# Altium schematic sheet Digit.SchDoc
size A3; DocumentNumber: 2; SheetNumber: 2; SheetTotal: 7
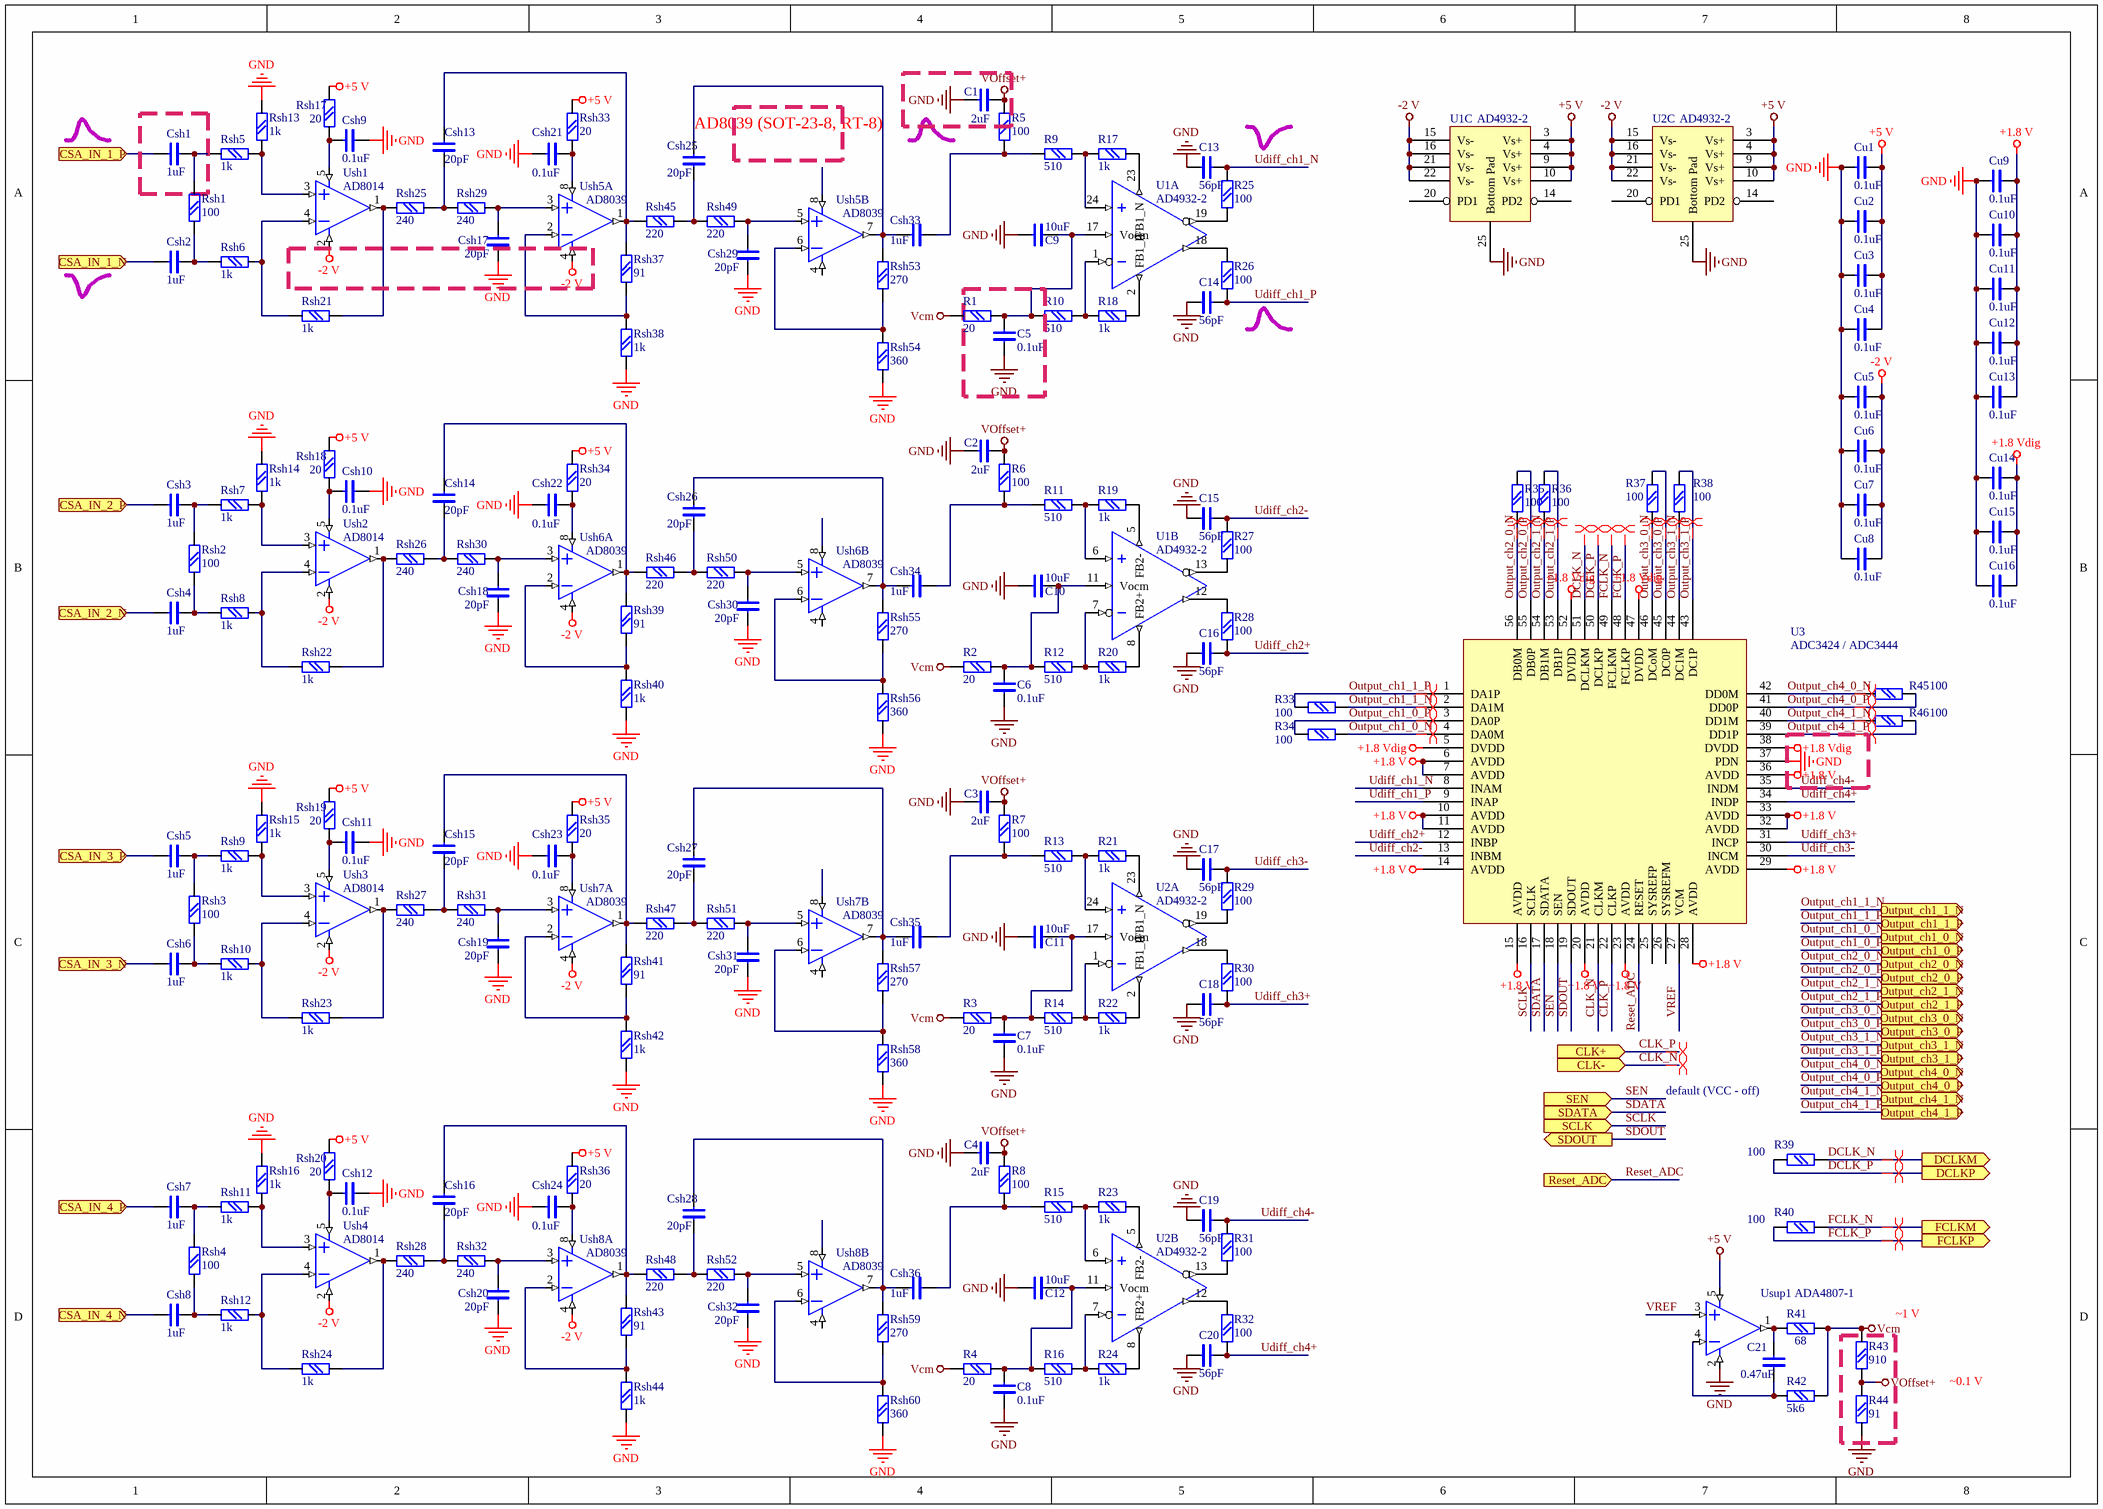
[diagram p0: Digit.SchDoc]

## Parts
C1  2uF  [chip0603]
C2  2uF  [chip0603]
C3  2uF  [chip0603]
C4  2uF  [chip0603]
C5  0.1uF  [chip0603]
C6  0.1uF  [chip0603]
C7  0.1uF  [chip0603]
C8  0.1uF  [chip0603]
C9  10uF  [chip0603]
C10  10uF  [chip0603]
C11  10uF  [chip0603]
C12  10uF  [chip0603]
C13  56pF  [chip0603]
C14  56pF  [chip0603]
C15  56pF  [chip0603]
C16  56pF  [chip0603]
C17  56pF  [chip0603]
C18  56pF  [chip0603]
C19  56pF  [chip0603]
C20  56pF  [chip0603]
C21  0.47uF  [chip0603]
Csh1  1uF  [chip0603]
Csh2  1uF  [chip0603]
Csh3  1uF  [chip0603]
Csh4  1uF  [chip0603]
Csh5  1uF  [chip0603]
Csh6  1uF  [chip0603]
Csh7  1uF  [chip0603]
Csh8  1uF  [chip0603]
Csh9  0.1uF  [chip0603]
Csh10  0.1uF  [chip0603]
Csh11  0.1uF  [chip0603]
Csh12  0.1uF  [chip0603]
Csh13  20pF  [chip0603]
Csh14  20pF  [chip0603]
Csh15  20pF  [chip0603]
Csh16  20pF  [chip0603]
Csh17  20pF  [chip0603]
Csh18  20pF  [chip0603]
Csh19  20pF  [chip0603]
Csh20  20pF  [chip0603]
Csh21  0.1uF  [chip0603]
Csh22  0.1uF  [chip0603]
Csh23  0.1uF  [chip0603]
Csh24  0.1uF  [chip0603]
Csh25  20pF  [chip0603]
Csh26  20pF  [chip0603]
Csh27  20pF  [chip0603]
Csh28  20pF  [chip0603]
Csh29  20pF  [chip0603]
Csh30  20pF  [chip0603]
Csh31  20pF  [chip0603]
Csh32  20pF  [chip0603]
Csh33  1uF  [chip0603]
Csh34  1uF  [chip0603]
Csh35  1uF  [chip0603]
Csh36  1uF  [chip0603]
Cu1  0.1uF  [chip0603]
Cu2  0.1uF  [chip0603]
Cu3  0.1uF  [chip0603]
Cu4  0.1uF  [chip0603]
Cu5  0.1uF  [chip0603]
Cu6  0.1uF  [chip0603]
Cu7  0.1uF  [chip0603]
Cu8  0.1uF  [chip0603]
Cu9  0.1uF  [chip0603]
Cu10  0.1uF  [chip0603]
Cu11  0.1uF  [chip0603]
Cu12  0.1uF  [chip0603]
Cu13  0.1uF  [chip0603]
Cu14  0.1uF  [chip0603]
Cu15  0.1uF  [chip0603]
Cu16  0.1uF  [chip0603]
R1  20  [chip0603]
R2  20  [chip0603]
R3  20  [chip0603]
R4  20  [chip0603]
R5  100  [chip0603]
R6  100  [chip0603]
R7  100  [chip0603]
R8  100  [chip0603]
R9  510  [chip0603]
R10  510  [chip0603]
R11  510  [chip0603]
R12  510  [chip0603]
R13  510  [chip0603]
R14  510  [chip0603]
R15  510  [chip0603]
R16  510  [chip0603]
R17  1k  [chip0603]
R18  1k  [chip0603]
R19  1k  [chip0603]
R20  1k  [chip0603]
R21  1k  [chip0603]
R22  1k  [chip0603]
R23  1k  [chip0603]
R24  1k  [chip0603]
R25  100  [chip0603]
R26  100  [chip0603]
R27  100  [chip0603]
R28  100  [chip0603]
R29  100  [chip0603]
R30  100  [chip0603]
R31  100  [chip0603]
R32  100  [chip0603]
R33  100  [0402]
R34  100  [0402]
R35  100  [0402]
R36  100  [0402]
R37  100  [0402]
R38  100  [0402]
R39  100  [0402]
R40  100  [0402]
R41  68  [chip0603]
R42  5k6  [chip0603]
R43  910  [chip0603]
R44  91  [chip0603]
R45  100  [0402]
R46  100  [0402]
Rsh1  100  [chip0603]
Rsh2  100  [chip0603]
Rsh3  100  [chip0603]
Rsh4  100  [chip0603]
Rsh5  1k  [chip0603]
Rsh6  1k  [chip0603]
Rsh7  1k  [chip0603]
Rsh8  1k  [chip0603]
Rsh9  1k  [chip0603]
Rsh10  1k  [chip0603]
Rsh11  1k  [chip0603]
Rsh12  1k  [chip0603]
Rsh13  1k  [chip0603]
Rsh14  1k  [chip0603]
Rsh15  1k  [chip0603]
Rsh16  1k  [chip0603]
Rsh17  20  [chip0603]
Rsh18  20  [chip0603]
Rsh19  20  [chip0603]
Rsh20  20  [chip0603]
Rsh21  1k  [chip0603]
Rsh22  1k  [chip0603]
Rsh23  1k  [chip0603]
Rsh24  1k  [chip0603]
Rsh25  240  [chip0603]
Rsh26  240  [chip0603]
Rsh27  240  [chip0603]
Rsh28  240  [chip0603]
Rsh29  240  [chip0603]
Rsh30  240  [chip0603]
Rsh31  240  [chip0603]
Rsh32  240  [chip0603]
Rsh33  20  [chip0603]
Rsh34  20  [chip0603]
Rsh35  20  [chip0603]
Rsh36  20  [chip0603]
Rsh37  91  [chip0603]
Rsh38  1k  [chip0603]
Rsh39  91  [chip0603]
Rsh40  1k  [chip0603]
Rsh41  91  [chip0603]
Rsh42  1k  [chip0603]
Rsh43  91  [chip0603]
Rsh44  1k  [chip0603]
Rsh45  220  [chip0603]
Rsh46  220  [chip0603]
Rsh47  220  [chip0603]
Rsh48  220  [chip0603]
Rsh49  220  [chip0603]
Rsh50  220  [chip0603]
Rsh51  220  [chip0603]
Rsh52  220  [chip0603]
Rsh53  270  [chip0603]
Rsh54  360  [chip0603]
Rsh55  270  [chip0603]
Rsh56  360  [chip0603]
Rsh57  270  [chip0603]
Rsh58  360  [chip0603]
Rsh59  270  [chip0603]
Rsh60  360  [chip0603]
U1  AD4932-2  [CP-24-13]  (parts A,B,C of 3)
U2  AD4932-2  [CP-24-13]  (parts A,B,C of 3)
U3  ADC3424 / ADC3444  [PQFN-56]
Ush1  AD8014  [RT-5]
Ush2  AD8014  [RT-5]
Ush3  AD8014  [RT-5]
Ush4  AD8014  [RT-5]
Ush5  AD8039  [SOT23-8]  (parts A,B of 2)
Ush6  AD8039  [SOT23-8]  (parts A,B of 2)
Ush7  AD8039  [SOT23-8]  (parts A,B of 2)
Ush8  AD8039  [SOT23-8]  (parts A,B of 2)
Usup1  ADA4807-1  [SOT23-5]

## Blocks framed on the sheet
~1 V: R43 R44

## Ports
CLK+ (in), CLK- (in), CSA_IN_1_N (in), CSA_IN_1_P (in), CSA_IN_2_N (in), CSA_IN_2_P (in), CSA_IN_3_N (in), CSA_IN_3_P (in), CSA_IN_4_N (in), CSA_IN_4_P (in), DCLKM (out), DCLKP (out), FCLKM (out), FCLKP (out), Output_ch1_0_N (out), Output_ch1_0_P (out), Output_ch1_1_N (out), Output_ch1_1_P (out), Output_ch2_0_N (out), Output_ch2_0_P (out), Output_ch2_1_N (out), Output_ch2_1_P (out), Output_ch3_0_N (out), Output_ch3_0_P (out), Output_ch3_1_N (out), Output_ch3_1_P (out), Output_ch4_0_N (out), Output_ch4_0_P (out), Output_ch4_1_N (out), Output_ch4_1_P (out), Reset_ADC (in), SCLK (in), SDATA (in), SDOUT (out), SEN (in)

## Nets
+1.8 V: Cu9.2 Cu10.2 Cu11.2 Cu12.2 Cu13.2 U3.6(AVDD) U3.7(AVDD) U3.10(AVDD) U3.11(AVDD) U3.14(AVDD) U3.15(AVDD) U3.20(AVDD) U3.23(AVDD) U3.28(AVDD) U3.29(AVDD) U3.32(AVDD) U3.33(AVDD) U3.36(AVDD)
+1.8 Vdig: Cu14.2 Cu15.2 Cu16.2 U3.5(DVDD) U3.38(DVDD) U3.47(DVDD) U3.52(DVDD)
+5 V: Cu1.2 Cu2.2 Cu3.2 Cu4.2 Rsh17.2 Rsh18.2 Rsh19.2 Rsh20.2 Rsh33.2 Rsh34.2 Rsh35.2 Rsh36.2 U1.3(Vs+) U1.4(Vs+) U1.9(Vs+) U1.10(Vs+) U2.3(Vs+) U2.4(Vs+) U2.9(Vs+) U2.10(Vs+) Usup1.5(E+)
-2 V: Cu5.2 Cu6.2 Cu7.2 Cu8.2 U1.15(Vs-) U1.16(Vs-) U1.21(Vs-) U1.22(Vs-) U2.15(Vs-) U2.16(Vs-) U2.21(Vs-) U2.22(Vs-) Ush1.2(E-) Ush2.2(E-) Ush3.2(E-) Ush4.2(E-) Ush5.4(E-) Ush6.4(E-) Ush7.4(E-) Ush8.4(E-)
GND: C1.1 C2.1 C3.1 C4.1 C5.1 C6.1 C7.1 C8.1 C9.1 C10.1 C11.1 C12.1 C13.2 C14.1 C15.2 C16.1 C17.2 C18.1 C19.2 C20.1 Csh9.2 Csh10.2 Csh11.2 Csh12.2 Csh17.2 Csh18.2 Csh19.2 Csh20.2 Csh21.2 Csh22.2 Csh23.2 Csh24.2 Csh29.2 Csh30.2 Csh31.2 Csh32.2 Cu1.1 Cu2.1 Cu3.1 Cu4.1 Cu5.1 Cu6.1 Cu7.1 Cu8.1 Cu9.1 Cu10.1 Cu11.1 Cu12.1 Cu13.1 Cu14.1 Cu15.1 Cu16.1 R44.2 Rsh13.2 Rsh14.2 Rsh15.2 Rsh16.2 Rsh38.1 Rsh40.1 Rsh42.1 Rsh44.1 Rsh54.1 Rsh56.1 Rsh58.1 Rsh60.1 U1.25(Bottom_Pad) U2.25(Bottom_Pad) U3.37(PDN) Usup1.2(E-)
Vcm: R1.2 R2.2 R3.2 R4.2 R41.2 R42.2 R43.1
VOffset+: C1.2 C2.2 C3.2 C4.2 R5.2 R6.2 R7.2 R8.2 R43.2 R44.1
CLK_N: U3.21(CLKM) ; port CLK-
CLK_P: U3.22(CLKP) ; port CLK+
CSA_IN_1_N: Csh2.1 ; port CSA_IN_1_N
CSA_IN_1_P: Csh1.1 ; port CSA_IN_1_P
CSA_IN_2_N: Csh4.1 ; port CSA_IN_2_N
CSA_IN_2_P: Csh3.1 ; port CSA_IN_2_P
CSA_IN_3_N: Csh6.1 ; port CSA_IN_3_N
CSA_IN_3_P: Csh5.1 ; port CSA_IN_3_P
CSA_IN_4_N: Csh8.1 ; port CSA_IN_4_N
CSA_IN_4_P: Csh7.1 ; port CSA_IN_4_P
DCLK_N: R39.2 U3.51(DCLKM) ; port DCLKM
DCLK_P: R39.1 U3.50(DCLKP) ; port DCLKP
FCLK_N: R40.2 U3.49(FCLKM) ; port FCLKM
FCLK_P: R40.1 U3.48(FCLKP) ; port FCLKP
Output_ch1_0_N: R34.2 U3.4(DA0M) ; port Output_ch1_0_N
Output_ch1_0_P: R34.1 U3.3(DA0P) ; port Output_ch1_0_P
Output_ch1_1_N: R33.2 U3.2(DA1M) ; port Output_ch1_1_N
Output_ch1_1_P: R33.1 U3.1(DA1P) ; port Output_ch1_1_P
Output_ch2_0_N: R35.1 U3.56(DB0M) ; port Output_ch2_0_N
Output_ch2_0_P: R35.2 U3.55(DB0P) ; port Output_ch2_0_P
Output_ch2_1_N: R36.1 U3.54(DB1M) ; port Output_ch2_1_N
Output_ch2_1_P: R36.2 U3.53(DB1P) ; port Output_ch2_1_P
Output_ch3_0_N: R37.1 U3.46(DCoM) ; port Output_ch3_0_N
Output_ch3_0_P: R37.2 U3.45(DC0P) ; port Output_ch3_0_P
Output_ch3_1_N: R38.1 U3.44(DC1M) ; port Output_ch3_1_N
Output_ch3_1_P: R38.2 U3.43(DC1P) ; port Output_ch3_1_P
Output_ch4_0_N: R45.1 U3.42(DD0M) ; port Output_ch4_0_N
Output_ch4_0_P: R45.2 U3.41(DD0P) ; port Output_ch4_0_P
Output_ch4_1_N: R46.1 U3.40(DD1M) ; port Output_ch4_1_N
Output_ch4_1_P: R46.2 U3.39(DD1P) ; port Output_ch4_1_P
Reset_ADC: U3.24(RESET) ; port Reset_ADC
SCLK: U3.16(SCLK) ; port SCLK
SDATA: U3.17(SDATA) ; port SDATA
SDOUT: U3.19(SDOUT) ; port SDOUT
SEN: U3.18(SEN) ; port SEN
Udiff_ch1_N: C13.1 R25.2 U3.8(INAM)
Udiff_ch1_P: C14.2 R26.2 U3.9(INAP)
Udiff_ch2+: C16.2 R28.2 U3.12(INBP)
Udiff_ch2-: C15.1 R27.2 U3.13(INBM)
Udiff_ch3+: C18.2 R30.2 U3.31(INCP)
Udiff_ch3-: C17.1 R29.2 U3.30(INCM)
Udiff_ch4+: C20.2 R32.2 U3.34(INDP)
Udiff_ch4-: C19.1 R31.2 U3.35(INDM)
VREF: U3.27(VCM) Usup1.3(+IN)
NetC5_2: C5.2 C9.2 R1.1 R10.2 U1.17(Vocm)
NetC6_2: C6.2 C10.2 R2.1 R12.2 U1.11(Vocm)
NetC7_2: C7.2 C11.2 R3.1 R14.2 U2.17(Vocm)
NetC8_2: C8.2 C12.2 R4.1 R16.2 U2.11(Vocm)
NetC21_1: C21.1 R41.1 Usup1.1(OUT)
NetC21_2: C21.2 R42.1 Usup1.4(-IN)
NetCsh1_2: Csh1.2 Rsh1.2 Rsh5.1
NetCsh2_2: Csh2.2 Rsh1.1 Rsh6.1
NetCsh3_2: Csh3.2 Rsh2.2 Rsh7.1
NetCsh4_2: Csh4.2 Rsh2.1 Rsh8.1
NetCsh5_2: Csh5.2 Rsh3.2 Rsh9.1
NetCsh6_2: Csh6.2 Rsh3.1 Rsh10.1
NetCsh7_2: Csh7.2 Rsh4.2 Rsh11.1
NetCsh8_2: Csh8.2 Rsh4.1 Rsh12.1
NetCsh9_1: Csh9.1 Rsh17.1 Ush1.5(E+)
NetCsh10_1: Csh10.1 Rsh18.1 Ush2.5(E+)
NetCsh11_1: Csh11.1 Rsh19.1 Ush3.5(E+)
NetCsh12_1: Csh12.1 Rsh20.1 Ush4.5(E+)
NetCsh13_1: Csh13.1 Rsh37.2 Rsh45.2 Ush5.1(OUT)
NetCsh13_2: Csh13.2 Rsh25.1 Rsh29.1
NetCsh14_1: Csh14.1 Rsh39.2 Rsh46.2 Ush6.1(OUT)
NetCsh14_2: Csh14.2 Rsh26.1 Rsh30.1
NetCsh15_1: Csh15.1 Rsh41.2 Rsh47.2 Ush7.1(OUT)
NetCsh15_2: Csh15.2 Rsh27.1 Rsh31.1
NetCsh16_1: Csh16.1 Rsh43.2 Rsh48.2 Ush8.1(OUT)
NetCsh16_2: Csh16.2 Rsh28.1 Rsh32.1
NetCsh17_1: Csh17.1 Rsh29.2 Ush5.3(+IN)
NetCsh18_1: Csh18.1 Rsh30.2 Ush6.3(+IN)
NetCsh19_1: Csh19.1 Rsh31.2 Ush7.3(+IN)
NetCsh20_1: Csh20.1 Rsh32.2 Ush8.3(+IN)
NetCsh21_1: Csh21.1 Rsh33.1 Ush5.8(E+)
NetCsh22_1: Csh22.1 Rsh34.1 Ush6.8(E+)
NetCsh23_1: Csh23.1 Rsh35.1 Ush7.8(E+)
NetCsh24_1: Csh24.1 Rsh36.1 Ush8.8(E+)
NetCsh25_1: Csh25.1 Csh33.1 Rsh53.2 Ush5.7(OUT)
NetCsh25_2: Csh25.2 Rsh45.1 Rsh49.1
NetCsh26_1: Csh26.1 Csh34.1 Rsh55.2 Ush6.7(OUT)
NetCsh26_2: Csh26.2 Rsh46.1 Rsh50.1
NetCsh27_1: Csh27.1 Csh35.1 Rsh57.2 Ush7.7(OUT)
NetCsh27_2: Csh27.2 Rsh47.1 Rsh51.1
NetCsh28_1: Csh28.1 Csh36.1 Rsh59.2 Ush8.7(OUT)
NetCsh28_2: Csh28.2 Rsh48.1 Rsh52.1
NetCsh29_1: Csh29.1 Rsh49.2 Ush5.5(+IN)
NetCsh30_1: Csh30.1 Rsh50.2 Ush6.5(+IN)
NetCsh31_1: Csh31.1 Rsh51.2 Ush7.5(+IN)
NetCsh32_1: Csh32.1 Rsh52.2 Ush8.5(+IN)
NetCsh33_2: Csh33.2 R5.1 R9.2
NetCsh34_2: Csh34.2 R6.1 R11.2
NetCsh35_2: Csh35.2 R7.1 R13.2
NetCsh36_2: Csh36.2 R8.1 R15.2
NetR9_1: R9.1 R17.1 U1.24(In+)
NetR10_1: R10.1 R18.2 U1.1(In-)
NetR11_1: R11.1 R19.1 U1.6(In+)
NetR12_1: R12.1 R20.2 U1.7(In-)
NetR13_1: R13.1 R21.1 U2.24(In+)
NetR14_1: R14.1 R22.2 U2.1(In-)
NetR15_1: R15.1 R23.1 U2.6(In+)
NetR16_1: R16.1 R24.2 U2.7(In-)
NetR17_2: R17.2 U1.23(FB1_N)
NetR18_1: R18.1 U1.2(FB1_P)
NetR19_2: R19.2 U1.5(FB2-)
NetR20_1: R20.1 U1.8(FB2+)
NetR21_2: R21.2 U2.23(FB1_N)
NetR22_1: R22.1 U2.2(FB1_P)
NetR23_2: R23.2 U2.5(FB2-)
NetR24_1: R24.1 U2.8(FB2+)
NetR25_1: R25.1 U1.19(Out-)
NetR26_1: R26.1 U1.18(Out+)
NetR27_1: R27.1 U1.13(Out-)
NetR28_1: R28.1 U1.12(Out+)
NetR29_1: R29.1 U2.19(Out-)
NetR30_1: R30.1 U2.18(Out+)
NetR31_1: R31.1 U2.13(Out-)
NetR32_1: R32.1 U2.12(Out+)
NetRsh5_2: Rsh5.2 Rsh13.1 Ush1.3(+IN)
NetRsh6_2: Rsh6.2 Rsh21.1 Ush1.4(-IN)
NetRsh7_2: Rsh7.2 Rsh14.1 Ush2.3(+IN)
NetRsh8_2: Rsh8.2 Rsh22.1 Ush2.4(-IN)
NetRsh9_2: Rsh9.2 Rsh15.1 Ush3.3(+IN)
NetRsh10_2: Rsh10.2 Rsh23.1 Ush3.4(-IN)
NetRsh11_2: Rsh11.2 Rsh16.1 Ush4.3(+IN)
NetRsh12_2: Rsh12.2 Rsh24.1 Ush4.4(-IN)
NetRsh21_2: Rsh21.2 Rsh25.2 Ush1.1(OUT)
NetRsh22_2: Rsh22.2 Rsh26.2 Ush2.1(OUT)
NetRsh23_2: Rsh23.2 Rsh27.2 Ush3.1(OUT)
NetRsh24_2: Rsh24.2 Rsh28.2 Ush4.1(OUT)
NetRsh37_1: Rsh37.1 Rsh38.2 Ush5.2(-IN)
NetRsh39_1: Rsh39.1 Rsh40.2 Ush6.2(-IN)
NetRsh41_1: Rsh41.1 Rsh42.2 Ush7.2(-IN)
NetRsh43_1: Rsh43.1 Rsh44.2 Ush8.2(-IN)
NetRsh53_1: Rsh53.1 Rsh54.2 Ush5.6(-IN)
NetRsh55_1: Rsh55.1 Rsh56.2 Ush6.6(-IN)
NetRsh57_1: Rsh57.1 Rsh58.2 Ush7.6(-IN)
NetRsh59_1: Rsh59.1 Rsh60.2 Ush8.6(-IN)

Not connected (* = marked no-connect by the designer): U1 14(PD2) 20(PD1); U2 14(PD2) 20(PD1); U3 25(SYSREFP) 26(SYSREFM)

## Layout directives
differential pair: CLK_N, CLK_P, DCLK_N, DCLK_P, FCLK_N, FCLK_P, Output_ch1_0_N, Output_ch1_0_P, Output_ch1_1_N, Output_ch1_1_P, Output_ch2_0_N, Output_ch2_0_P, Output_ch2_1_N, Output_ch2_1_P, Output_ch3_0_N, Output_ch3_0_P, Output_ch3_1_N, Output_ch3_1_P, Output_ch4_0_N, Output_ch4_0_P, Output_ch4_1_N, Output_ch4_1_P

## Notes on the sheet
- (near Csh25) AD8039 (SOT-23-8, RT-8)
- default (VCC - off)
- ~0.1 V

## Library data of the parts
C1-C21 Csh1-Csh36 Cu1-Cu16 = C: Text Field1: 20; Text Field2: 10
R1-R4 Rsh17-Rsh20 Rsh33-Rsh36 = R: Text Field1: 20; Text Field2: 20
R5-R46 Rsh1-Rsh16 Rsh21-Rsh32 Rsh37-Rsh60 = R: Text Field1: 20; Text Field2: 20
U3 = ADC3424
Ush1-Ush4 Usup1 = AD8005ART: Text Field1: 40; Text Field2: 40
Ush5-Ush8 = AD8008